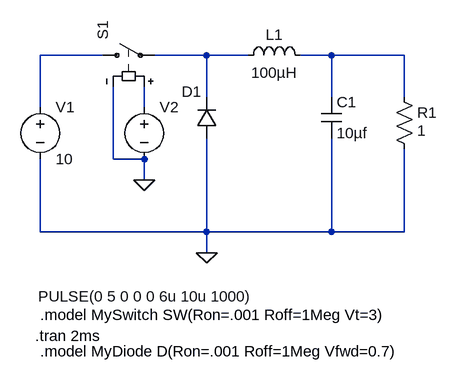
[diagram p0: schematic Buck Converter.asc]
Buck Converter.asc, the LTspice schematic file:
Version 4
SHEET 1 1116 680
WIRE -144 240 -144 160
WIRE -144 432 -144 320
WIRE -48 160 -144 160
WIRE -32 320 -32 208
WIRE 16 240 16 208
WIRE 16 320 -32 320
WIRE 16 352 16 320
WIRE 112 160 32 160
WIRE 112 224 112 160
WIRE 112 432 -144 432
WIRE 112 432 112 288
WIRE 112 464 112 432
WIRE 176 160 112 160
WIRE 304 160 256 160
WIRE 304 224 304 160
WIRE 304 432 112 432
WIRE 304 432 304 288
WIRE 416 160 304 160
WIRE 416 224 416 160
WIRE 416 432 304 432
WIRE 416 432 416 304
FLAG 16 352 0
FLAG 112 464 0
SYMBOL voltage -144 224 R0
WINDOW 123 0 0 Left 0
WINDOW 39 0 0 Left 0
SYMATTR InstName V1
SYMATTR Value 10
SYMBOL sw -64 160 R270
WINDOW 3 24 104 Invisible 0
SYMATTR Value MySwitch
SYMATTR InstName S1
SYMBOL ind 160 176 R270
WINDOW 0 32 56 VTop 0
WINDOW 3 5 56 VBottom 0
SYMATTR InstName L1
SYMATTR Value 100µH
SYMBOL diode 128 288 R180
WINDOW 0 24 72 Left 0
WINDOW 3 24 0 Invisible 0
SYMATTR InstName D1
SYMATTR Value MyDiode
SYMBOL cap 288 224 R0
SYMATTR InstName C1
SYMATTR Value 10µf
SYMBOL res 400 208 R0
WINDOW 3 36 68 Left 0
SYMATTR Value 1
SYMATTR InstName R1
SYMBOL voltage 16 224 R0
WINDOW 3 -163 307 Left 0
WINDOW 123 0 0 Left 0
WINDOW 39 0 0 Left 0
SYMATTR Value PULSE(0 5 0 0 0 6u 10u 1000)
SYMATTR InstName V2
TEXT -144 560 Left 0 !.model MySwitch SW(Ron=.001 Roff=1Meg Vt=3)
TEXT -152 592 Left 0 !.tran 2ms
TEXT -144 616 Left 0 !.model MyDiode D(Ron=.001 Roff=1Meg Vfwd=0.7)

The netlist it stands for:
* Buck Converter.asc
V1 N001 0 10
S1 N001 N003 N002 0 MySwitch
L1 N003 N004 100µH
D1 0 N003 MyDiode
C1 N004 0 10µf
R1 N004 0 1
V2 N002 0 PULSE(0 5 0 0 0 6u 10u 1000)
.model D D
.lib standard.dio
.model MySwitch SW(Ron=.001 Roff=1Meg Vt=3)
.tran 2ms
.model MyDiode D(Ron=.001 Roff=1Meg Vfwd=0.7)
.backanno
.end